# EAGLE design PS-VCO (EAGLE 6.6.0)

## Sheet 1 of 3
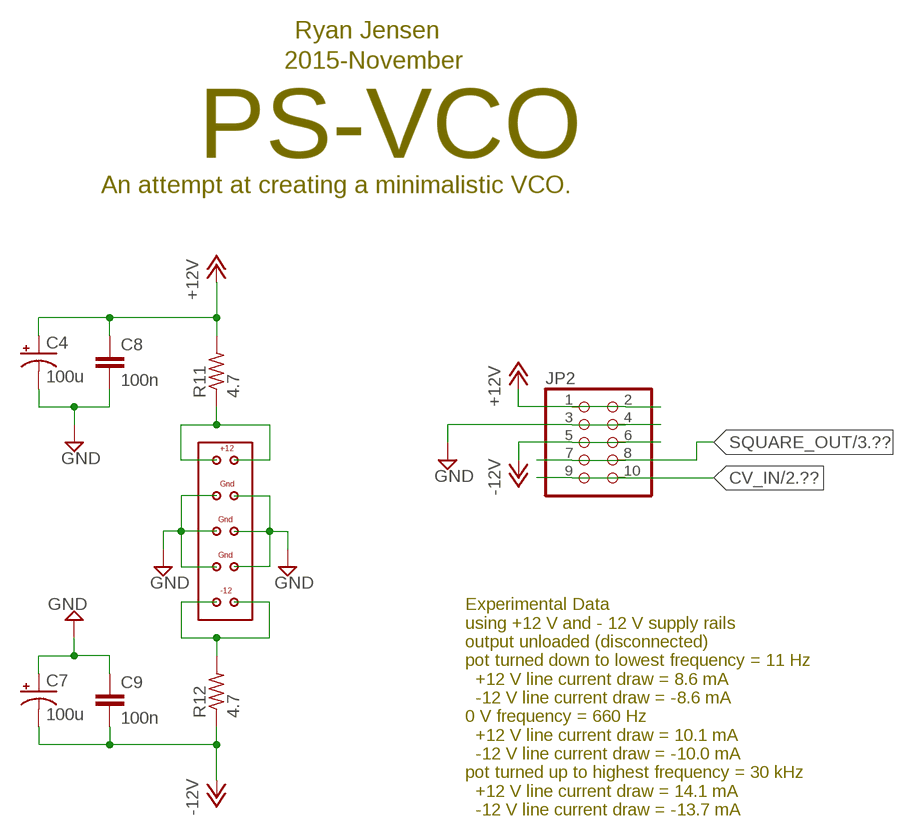
[diagram p0: schematic, sheet 1]

### Parts
C4  100u  CPOL-USE2.5-7  [E2,5-7]
C7  100u  CPOL-USE2.5-7  [E2,5-7]
C8  100n  C-EUC0603  [C0603]
C9  100n  C-EUC0603  [C0603]
JP2  PINHD-2X5  [2X05]
R11  4.7  R-US_R0603  [R0603]
R12  4.7  R-US_R0603  [R0603]
U$3  EURORACK-POWER  [EURORACK-POWER]

### Nets
+12V: C4.+ C8.1 JP2.1 JP2.2 R11.2 ; also sheet 2,3
-12V: C7.- C9.2 JP2.5 JP2.6 R12.1 ; also sheet 2,3
CV_IN: JP2.9 JP2.10 ; also sheet 2
GND: C4.- C7.+ C8.2 C9.1 JP2.3 JP2.4 U$3.P$3 U$3.P$4 U$3.P$5 U$3.P$6 U$3.P$7 U$3.P$8 ; also sheet 2,3
N$2: R12.2 U$3.P$9 U$3.P$10
N$5: R11.1 U$3.P$1 U$3.P$2
SQUARE_OUT: JP2.7 JP2.8 ; also sheet 3

### Notes on the sheet
- Ryan Jensen
- 2015-November
- PS-VCO
- An attempt at creating a minimalistic VCO.
- Experimental Data
  using +12 V and - 12 V supply rails
  output unloaded (disconnected)
  pot turned down to lowest frequency = 11 Hz
    +12 V line current draw = 8.6 mA
    -12 V line current draw = -8.6 mA
  0 V frequency = 660 Hz
    +12 V line current draw = 10.1 mA
    -12 V line current draw = -10.0 mA
  pot turned up to highest frequency = 30 kHz
    +12 V line current draw = 14.1 mA
    -12 V line current draw = -13.7 mA

## Sheet 2 of 3
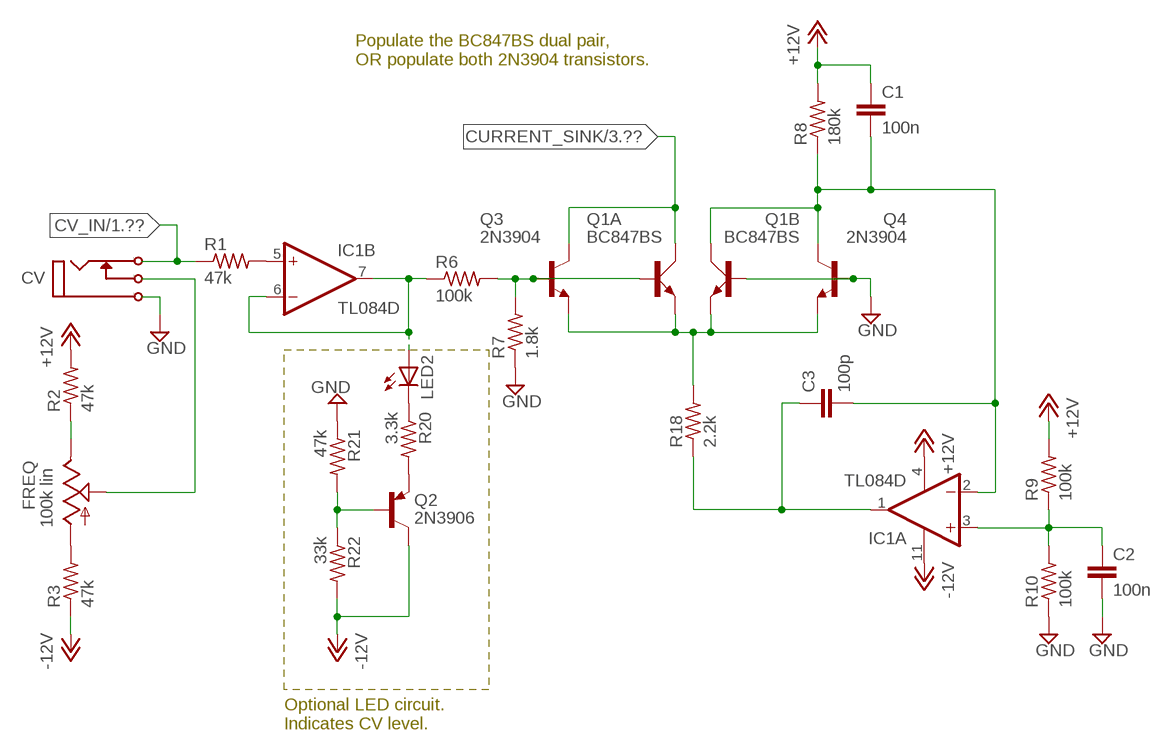
[diagram p1: schematic, sheet 2]

### Parts
C1  100n  C-EUC0603  [C0603]
C2  100n  C-EUC0603  [C0603]
C3  100p  C-EUC0603  [C0603]
CV  CV  MONO_JACK  [MONO_JACK]
FREQ  100k lin  TRIM_US-B64Y  [B64Y]
IC1  TL084D  [SO14]
LED2  LED_ELD260  [LED_LD260]
Q1  BC847BS  [SOT363_PHILIPS]
Q2  2N3906  [TO92]
Q3  2N3904  [TO92]
Q4  2N3904  [TO92]
R1  47k  R-US_R0603  [R0603]
R2  47k  R-US_R0603  [R0603]
R3  47k  R-US_R0603  [R0603]
R6  100k  R-US_R0603  [R0603]
R7  1.8k  R-US_R0603  [R0603]
R8  180k  R-US_R0603  [R0603]
R9  100k  R-US_R0603  [R0603]
R10  100k  R-US_R0603  [R0603]
R18  2.2k  R-US_R0603  [R0603]
R20  3.3k  R-US_R0603  [R0603]
R21  47k  R-US_R0603  [R0603]
R22  33k  R-US_R0603  [R0603]

### Nets
+12V: C1.1 IC1.4(P:V+) R2.2 R8.2 R9.2 ; also sheet 1,3
-12V: IC1.11(P:V-) Q2.1(C) R3.1 R22.2 ; also sheet 1,3
CURRENT_SINK: Q1.6(A:C) Q3.1(C) ; also sheet 3
CV_IN: CV.P$2(P2) R1.1 ; also sheet 1
CV_LED: IC1.6(B:-IN) IC1.7(B:OUT) LED2.A R6.1
GND: C2.2 CV.P$1 Q1.5(B:B) Q4.2(B) R7.1 R10.1 R21.1 ; also sheet 1,3
N$3: Q1.1(A:E) Q1.4(B:E) Q3.3(E) Q4.3(E) R18.2
N$4: Q1.2(A:B) Q3.2(B) R6.2 R7.2
N$6: C2.1 IC1.3(A:+IN) R9.1 R10.2
N$7: FREQ.E R2.1
N$8: FREQ.A R3.2
N$9: CV.P$3(P3) FREQ.S
N$11: IC1.5(B:+IN) R1.2
N$13: Q2.3(E) R20.2
N$14: LED2.K(C) R20.1
N$15: Q2.2(B) R21.2 R22.1
N$21: C3.1 IC1.1(A:OUT) R18.1
N$22: C1.2 C3.2 IC1.2(A:-IN) Q1.3(B:C) Q4.1(C) R8.1

### Notes on the sheet
- Populate the BC847BS dual pair,
  OR populate both 2N3904 transistors.
- Optional LED circuit.
  Indicates CV level.

## Sheet 3 of 3
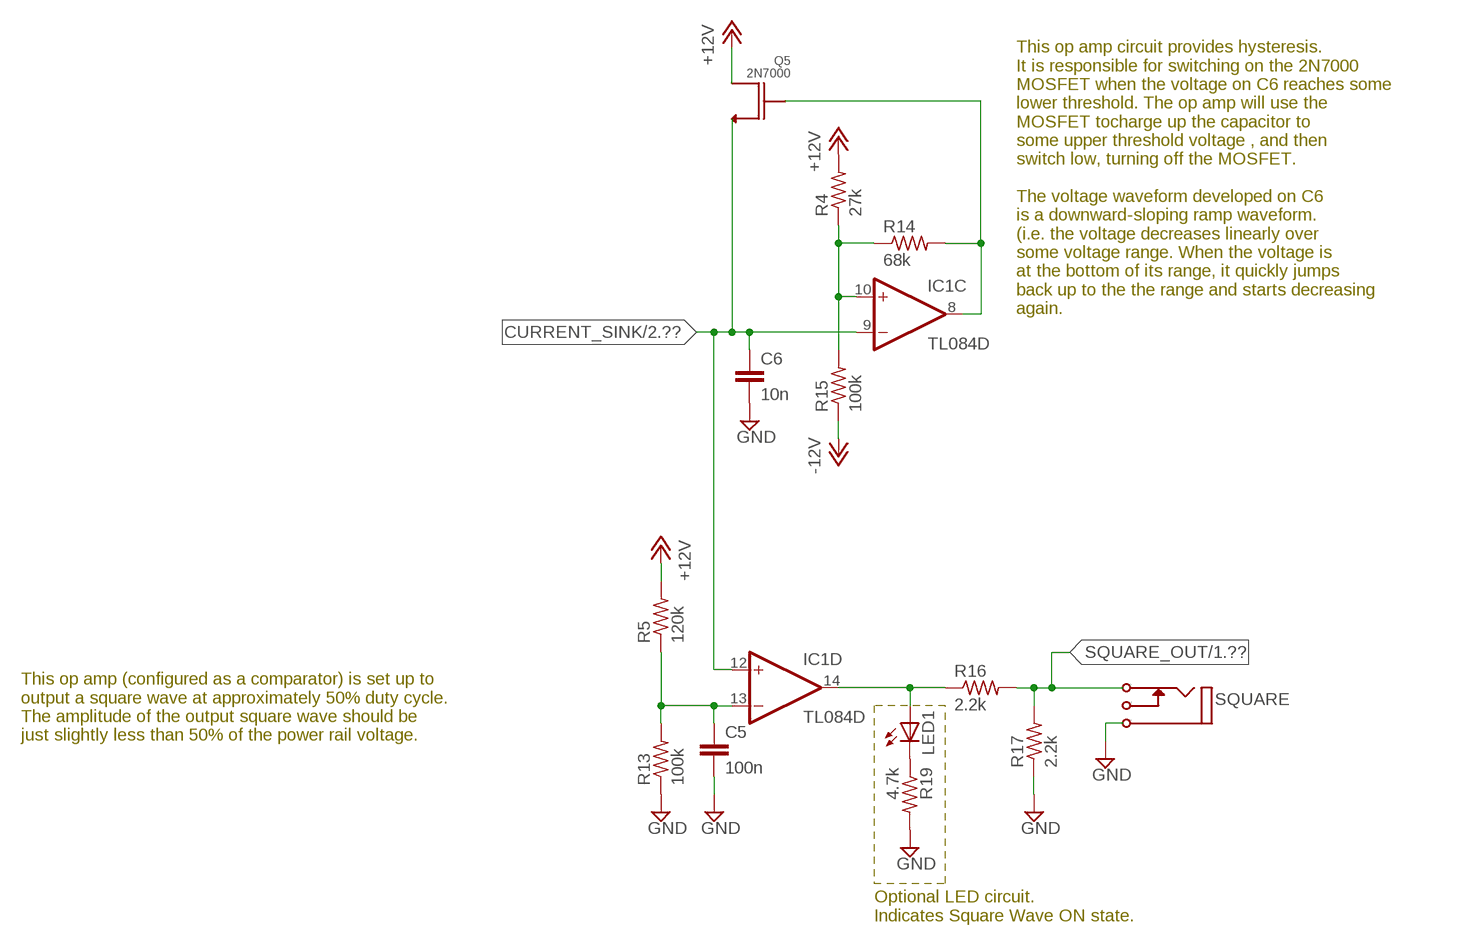
[diagram p2: schematic, sheet 3]

### Parts
C5  100n  C-EUC0603  [C0603]
C6  10n  C-EUC0603  [C0603]
LED1  LED_ELD260  [LED_LD260]
Q5  2N7000  [2N7000]
R4  27k  R-US_R0603  [R0603]
R5  120k  R-US_R0603  [R0603]
R13  100k  R-US_R0603  [R0603]
R14  68k  R-US_R0603  [R0603]
R15  100k  R-US_R0603  [R0603]
R16  2.2k  R-US_R0603  [R0603]
R17  2.2k  R-US_R0603  [R0603]
R19  4.7k  R-US_R0603  [R0603]
SQUARE  I/O  MONO_JACK  [MONO_JACK]

### Nets
+12V: Q5.D R4.2 R5.2 ; also sheet 1,2
-12V: R15.1 ; also sheet 1,2
CURRENT_SINK: C6.1 IC1.9(C:-IN) IC1.12(D:+IN) Q5.S ; also sheet 2
GND: C5.2 C6.2 R13.1 R17.1 R19.2 SQUARE.P$1 ; also sheet 1,2
N$1: IC1.10(C:+IN) R4.1 R14.1 R15.2
N$12: LED1.K(C) R19.1
N$16: C5.1 IC1.13(D:-IN) R5.1 R13.2
N$18: IC1.14(D:OUT) LED1.A R16.1
N$19: IC1.8(C:OUT) Q5.G R14.2
SQUARE_OUT: R16.2 R17.2 SQUARE.P$2(P2) ; also sheet 1
Unconnected: SQUARE.P$3(P3)

### Notes on the sheet
- This op amp circuit provides hysteresis.
  It is responsible for switching on the 2N7000
  MOSFET when the voltage on C6 reaches some
  lower threshold. The op amp will use the
  MOSFET tocharge up the capacitor to
  some upper threshold voltage , and then
  switch low, turning off the MOSFET.
  
  The voltage waveform developed on C6
  is a downward-sloping ramp waveform.
  (i.e. the voltage decreases linearly over
  some voltage range. When the voltage is
  at the bottom of its range, it quickly jumps
  back up to the the range and starts decreasing
  again.
- This op amp (configured as a comparator) is set up to
  output a square wave at approximately 50% duty cycle.
  The amplitude of the output square wave should be
  just slightly less than 50% of the power rail voltage.
- Optional LED circuit.
  Indicates Square Wave ON state.

## Library data of the parts
C1-C3 C5 C6 C8 C9 = rcl:C-EU: CAPACITOR, European symbol
C4 C7 = rcl:CPOL-US: POLARIZED CAPACITOR, American symbol
CV = !synth_sch:MONO_JACK; VALUE: I/O
FREQ = pot:TRIM_US-: POTENTIOMETER
IC1 = linear:TL084: OP AMP
JP2 = pinhead:PINHD-2X5: PIN HEADER
LED1 LED2 = eagle-ltspice:LED_E: LED Source: http://www.osram.convergy.de Source: www.luxeon.com Source: www.kingbright.com; SPICEMODEL: NONE; SPICEPREFIX: D; SPICETYPE: diode
Q1 = transistor-small-signal:BC847BS: NPN general purpose double transistor Source: http://www.farnell.com/datasheets/2466.pdf
Q2 = transistor-pnp:2N3906: PNP Transistor
Q3 Q4 = transistor:2N3904: NPN TRANSISTOR
Q5 = !synth_sch:2N7000
R1-R22 = rcl:R-US_: RESISTOR, American symbol
SQUARE = !synth_sch:MONO_JACK
U$3 = !synth_sch:EURORACK-POWER

## Board
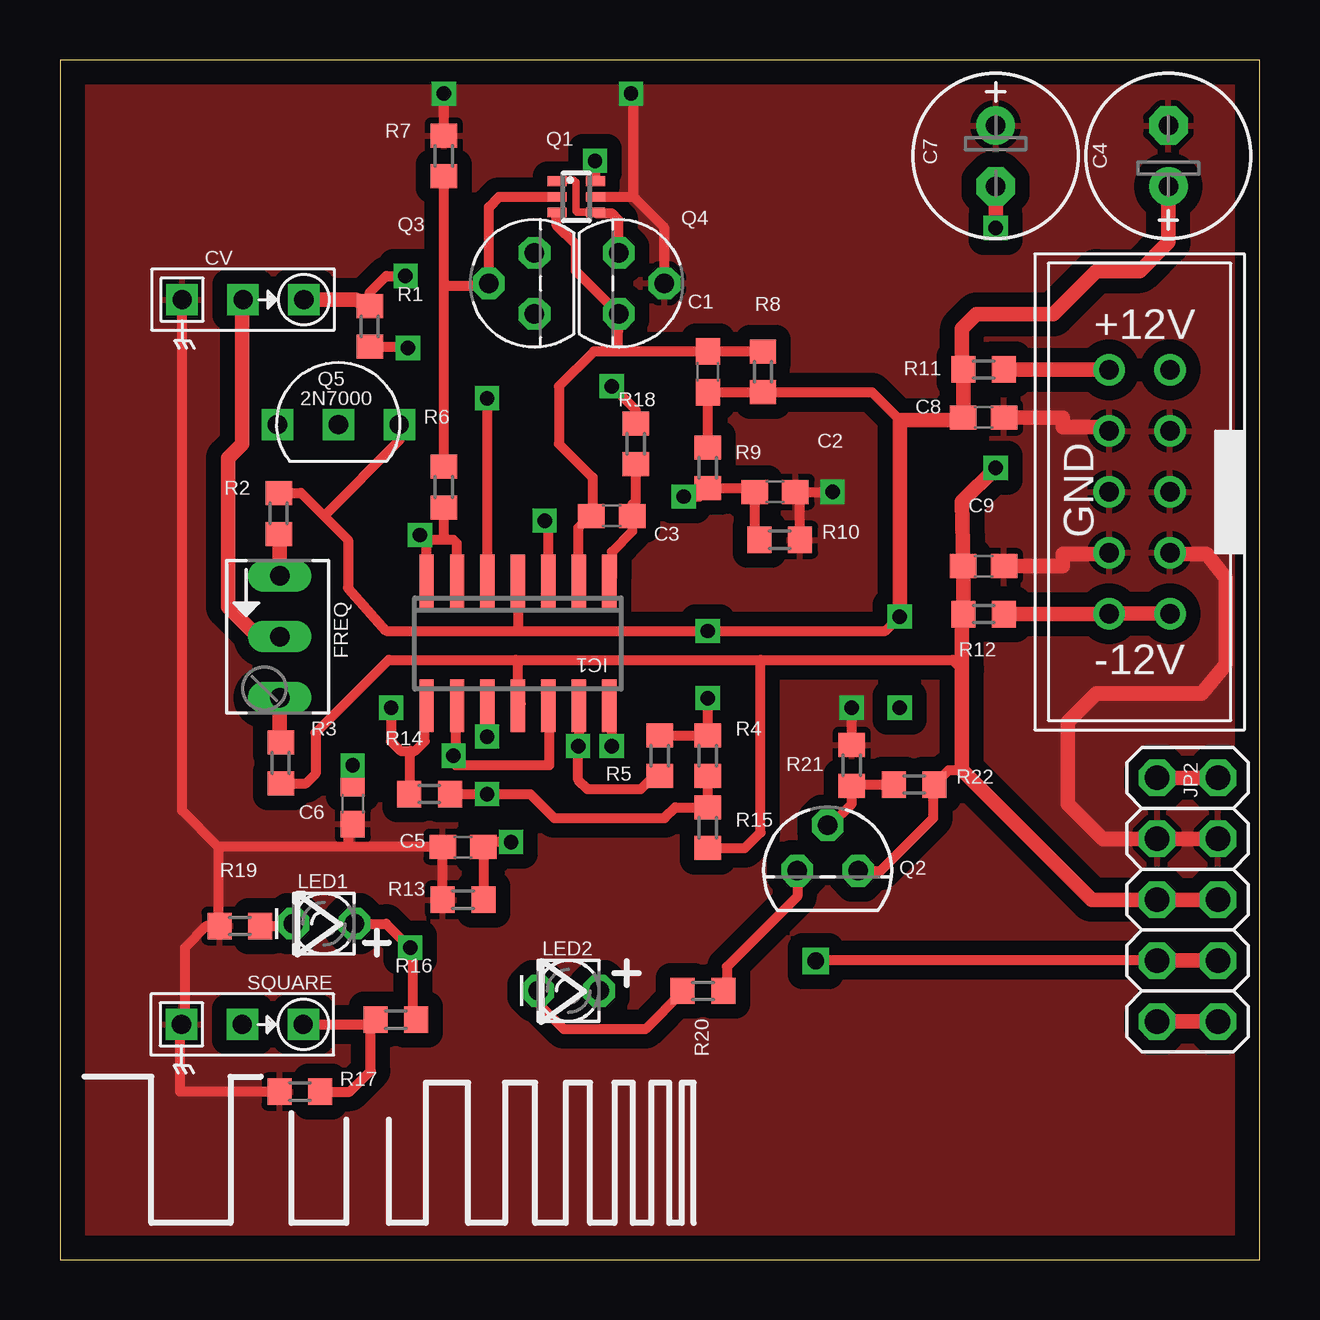
[diagram p3: board, top side]
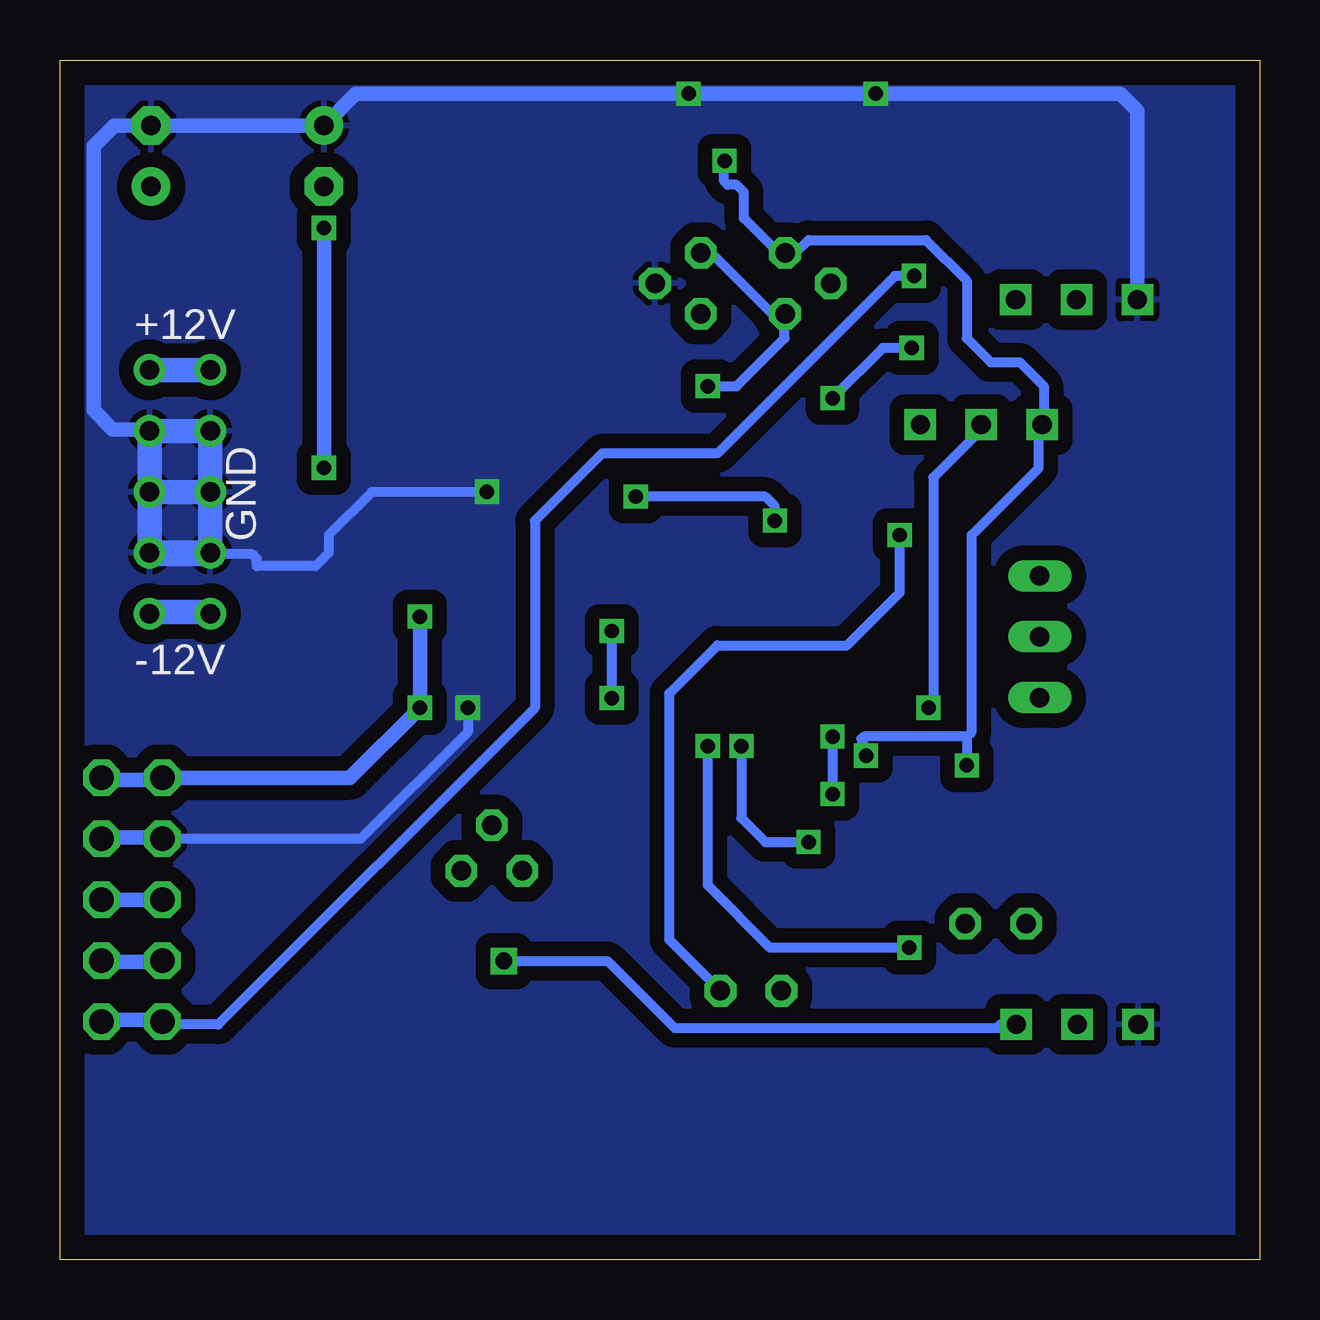
[diagram p4: board, bottom side, seen from below]

Size 50 x 50 mm. Coordinates in mm from the lower left corner, seen from the top.
Outline: 0,0 50,0 50,50 0,50 0,0
Copper layers (1*16): Top 0.035mm / dielectric 1.5mm / Bottom 0.035mm
Design rules "default": minimum track width 10mil, minimum drill 24mil, track to track 8mil, track to pad 8mil, pad to pad 8mil, via to via 8mil, smd to smd 8mil, copper to edge 40mil, drill to drill 8mil, minimum pad ring 10mil, minimum via ring 8mil, stop-mask expansion 4mil, vias tented up to drill 0mil, thermal gap 10mil

### Footprints (pad centres in the part's own frame; a part is rotated, then mirrored left to right if it is on the bottom)
C0603 = smd 1.1 x 1: 1 -0.85,0; 2 0.85,0
E2,5-7 = drill 0.813 pad 1.6: + -1.27,0 | drill 0.813 pad 1.6 octagon: - 1.27,0
MONO_JACK = drill 0.8 square: P$1 -2.54,0; P$2 2.54,0; P$3 0,0
B64Y = drill 0.813 long: A 2.54,0; E -2.54,0; S 0,0
SO14 = smd 0.6 x 2.2: 1 -3.81,-2.6; 2 -2.54,-2.6; 3 -1.27,-2.6; 4 0,-2.6; 5 1.27,-2.6; 6 2.54,-2.6; 7 3.81,-2.6; 8 3.81,2.6; 9 2.54,2.6; 10 1.27,2.6; 11 0,2.6; 12 -1.27,2.6; 13 -2.54,2.6; 14 -3.81,2.6
2X05 = drill 1.016 octagon: 1 -5.08,-1.27; 2 -5.08,1.27; 3 -2.54,-1.27; 4 -2.54,1.27; 5 0,-1.27; 6 0,1.27; 7 2.54,-1.27; 8 2.54,1.27; 9 5.08,-1.27; 10 5.08,1.27
LED_LD260 = drill 0.813 octagon: A -1.27,0; K 1.27,0
SOT363_PHILIPS = smd 0.4 x 0.8: 1 -0.65,-0.8; 2 0,-0.8; 3 0.65,-0.8; 4 0.65,0.8; 5 0,0.8; 6 -0.65,0.8
TO92 = drill 0.813 octagon: 1 1.27,0; 2 0,1.905; 3 -1.27,0
2N7000 = drill 0.8 square: D 2.54,0; G 0,0; S -2.54,0
R0603 = smd 1 x 1.1: 1 -0.85,0; 2 0.85,0
EURORACK-POWER = drill 0.8: P$1 -1.27,5.08; P$2 1.27,5.08; P$3 -1.27,2.54; P$4 1.27,2.54; P$5 -1.27,0; P$6 1.27,0; P$7 -1.27,-2.54; P$8 1.27,-2.54; P$9 -1.27,-5.08; P$10 1.27,-5.08

### Placement (x,y rotation side)
C1  27,37 90 top
C2  29.8,32 0 top
C3  23,31 180 top
C4  46.2,46 90 top
C5  16.8,17.2 180 top
C6  12.2,19 270 top
C7  39,46 270 top
C8  38.5,35.1 0 top
C9  38.5,28.9 180 top
CV  7.63,40.01 0 top
FREQ  9.16,25.96 270 top
IC1  19.09,25.68 180 top
JP2  47,15 270 top
LED1  11,14 180 top
LED2  21.2,11.2 180 top
Q1  21.52,44.3 270 top
Q2  32,16.2 0 top
Q3  19.78,40.69 90 top
Q4  23.29,40.69 270 top
Q5  11.6,34.8 0 top
R1  12.91,38.9 270 top
R2  9.12,31.1 90 top
R3  9.2,20.7 90 top
R4  27,21 90 top
R5  25,21 90 top
R6  16,32.2 90 top
R7  16,46 270 top
R8  29.3,37 270 top
R9  27,33 90 top
R10  30,30 180 top
R11  38.5,37.1 180 top
R12  38.5,26.9 0 top
R13  16.8,15 0 top
R14  15.4,19.4 180 top
R15  27,18 90 top
R16  14,10 180 top
R17  10,7 0 top
R18  24,34 90 top
R19  7.5,13.9 180 top
R20  26.8,11.2 0 top
R21  33,20.6 270 top
R22  35.6,19.8 0 top
SQUARE  7.6,9.8 0 top
U$3  45,32 0 top

### Tracks (layer width: path | path; a pad name or v marks a point on that pad's centre or on a via)
+12V  (via drill 0.6)
  Top 0.406: R2.2 10.05,31.95 11,31 | 11,31 12,30 12,28 13.6,26.2 19.2,26.2 | 19,28.19 IC1.4 19.09,26.31 19.2,26.2 | 19.2,26.2 v27,26.2 34.4,26.2 v35,26.8 | Q5.D 14.14,34.14 11,31 | R9.2 C1.1 R8.2 33.85,36.15 35,35 | v27,23.4 R4.2 R5.2
  Top 0.61: C4.+ 46.2,42.4 45,41.2 43.2,41.2 41.4,39.4 38.2,39.4 37.6,38.8 37.6,37.1 R11.2 C8.1 37.55,35 35,35 v35,26.8 | JP2.2 JP2.1
  Bottom 0.406: v27,23.4 v27,26.2
  Bottom 0.61: JP2.1 37.92,20.08 v35,23 v35,26.8
-12V  (via drill 0.6)
  Top 0.406: R3.1 10.25,19.85 10.65,20.25 10.65,21.95 13.7,25 19,25 | 19.2,23.17 IC1.11 19.09,24.91 19,25 | 19,25 29.2,25 | 29.2,25 37.2,25 37.6,24.6 | R15.1 28.55,17.15 29.2,17.8 29.2,25 | 37.6,20.4 37.05,20.4 R22.2 36.4,19.75 36.4,18.4 34.2,16.2 Q2.1
  Top 0.61: C7.- v39,43 | v39,33 37.6,31.6 C9.2 R12.1 37.6,26.85 37.6,24.6 37.6,20.4 43,15 JP2.5 JP2.6
  Bottom 0.61: v39,43 v39,33
CURRENT_SINK  (via drill 0.6)
  Top 0.406: v22.3,45.8 22.3,44.97 Q1.6 | IC1.9 16.5,23.03 16.5,21.4 16.6,21.3 | 16.6,21.3 16.5,20.6 20.4,20.6 20.4,22.2 20.36,22.24 IC1.12 | 16.6,21.3 v16.4,21 | v12.2,20.6 C6.1
  Bottom 0.406: v22.3,45.8 22.32,45.78 Q1.6 22.17,44.8 21.8,44.8 21.5,44.5 21.5,43.4 20.06,41.96 Q3.1 19.34,41.96 18.8,42.5 13.9,42.5 12.2,40.8 12.2,38.4 11.2,37.4 10,37.4 9,36.4 9,34.86 Q5.S 9.2,34.66 9.2,33 12,30.2 12,22 12.2,21.8 | 12.2,21.8 16.5,21.8 16.6,21.7 v16.4,21 | 12.2,21.8 v12.2,20.6
CV_IN  (via drill 0.6)
  Top 0.406: R1.1 12.91,40.31 13.6,41 v14.4,41
  Top 0.61: JP2.9 JP2.10 | CV.P$2 12.35,40.01 R1.1
  Bottom 0.406: v14.4,41 15.2,41 22.6,33.6 27.4,33.6 30.2,30.8 30.2,23 43.4,9.8 45.61,9.8 JP2.9
CV_LED  (via drill 0.6)
  Top 0.406: IC1.6 16.55,29.85 16.4,30 16,30 | IC1.7 15.28,29.88 15.4,30 | 16,30 R6.1 | 16,30 15.4,30 | v15,30.2 15.4,30
  Bottom 0.406: LED2.A 24.6,13.33 24.6,23.6 22.6,25.6 17.2,25.6 15,27.8 v15,30.2
GND  (via drill 0.6)
  Top 0.406: Q4.2 25.2,43.01 23.9,44.3 | Q1.5 23.9,44.3 | 23.9,44.3 23.9,48.7 v23.8,48.6 | R7.1 v16,48.6 | R17.1 5,7 5,9.74 SQUARE.P$1 5.2,9.94 5.2,13 6.1,13.9 R19.2 6.6,13.95 6.6,17.2 | 12,17.2 6.6,17.2 | R10.1 30.85,31.8 C2.2 v32.2,32 | R13.1 C5.2 12,17.2 | C6.2 12,17.95 12,17.2 | 6.6,17.2 5.09,18.71 CV.P$1 | R21.1 v33,23
  Top 0.61: C8.2 41.8,35.1 41.8,34.7 43.73,34.7 U$3.P$3 | C9.1 41.8,28.9 41.8,29.4 43.73,29.4 U$3.P$7 | JP2.4 JP2.3 43.46,17.54 42,19 42,22.4 43.2,23.6 47.6,23.6 48.6,24.8 48.6,28.4 47.8,29.4 46.33,29.4 U$3.P$8
  Bottom 0.406: v32.2,32 37,32 38.8,30.2 38.8,29.45 C9.1 41.8,28.9 41.8,29.2 42,29.4 43.67,29.4 U$3.P$7 | v33,23 33,22 37.46,17.54 JP2.3
  Bottom 0.61: C4.- C7.+ | C7.+ 47.73,47.27 48.6,46.4 48.6,35.4 47.8,34.6 46.33,34.6 U$3.P$4 | CV.P$1 5.09,47.89 5.8,48.6 v16,48.6 v23.8,48.6 37.67,48.6 C7.+
  Bottom 1.016: U$3.P$6 U$3.P$4 U$3.P$3 U$3.P$5 | U$3.P$5 U$3.P$6 | 46.3,32 U$3.P$6 | U$3.P$6 U$3.P$8 | U$3.P$5 U$3.P$7 46.2,29.46 46.2,29.4 43.8,29.4
  pour Bottom (isolate 0.61): 0,0 0,50 50,50 50,0
  pour Top (isolate 0.61): 0,50 0,0 50,0 50,50
N$1  (via drill 0.6)
  Top 0.406: R4.1 R15.2 25.65,18.85 25.2,18.4 20.6,18.4 19.6,19.4 v17.8,19.4 R14.1 | IC1.10 17.8,23.06 v17.8,21.8
  Bottom 0.406: v17.8,21.8 v17.8,19.4
N$2
  Top 0.61: R12.2 43.73,26.9 U$3.P$9 U$3.P$10
N$3  (via drill 0.6)
  Top 0.305: Q1.4 21.55,43.65 21.5,43.7 21.5,44.9 21.4,45 20.77,45 Q1.1
  Top 0.406: Q4.3 23.29,43.31 23,43.6 22.37,43.6 Q1.4 | R18.2 24,35.4 v23,36.4
  Bottom 0.406: Q4.3 23.13,41.8 22.7,41.8 20.32,39.42 Q3.3 19.8,39.4 19.8,38.4 21.8,36.4 v23,36.4
N$4
  Top 0.406: 16,40.6 R7.2 | R6.2 16,40.6 | 16,40.6 17.79,40.6 Q3.2 17.88,43.88 18.3,44.3 Q1.2
N$5
  Top 0.61: R11.1 43.73,37.1 U$3.P$1
  Bottom 1.016: U$3.P$2 U$3.P$1
N$6  (via drill 0.6)
  Top 0.406: IC1.3 20.36,30.64 v20.2,30.8 | v26,31.8 26.65,31.8 R9.1 28.8,32.15 C2.1 28.95,30.2 R10.2
  Bottom 0.406: v20.2,30.8 20.2,31.4 20.6,31.8 v26,31.8
N$7
  Top 0.61: FREQ.E 9.16,30.21 R2.1
N$8
  Top 0.61: FREQ.A 9.16,21.59 R3.2
N$9
  Top 0.61: FREQ.S 8.24,25.96 7,27.2 7,33.4 7.6,34 7.6,39.98 CV.P$3
N$10
  Bottom 1.016: 46,27 43.8,27
N$11  (via drill 0.6)
  Top 0.406: R1.2 14.45,38.05 v14.5,38 | v17.8,35.9 17.8,28.3 IC1.5
  Bottom 0.406: v14.5,38 15.7,38 v17.8,35.9
N$12
  Top 0.406: R19.1 9.63,13.9 LED1.K
N$13
  Top 0.406: Q2.3 30.73,15.13 27.8,12.2 27.8,11.35 R20.2
N$14
  Top 0.406: R20.1 25.95,11.15 24.4,9.6 21,9.6 20,10.6 20,11.13 LED2.K
N$15
  Top 0.406: R22.1 33.05,19.8 R21.2 33,19 32.1,18.11 Q2.2
N$16  (via drill 0.6)
  Top 0.406: IC1.13 21.63,21.43 v21.6,21.4 21.6,20 22,19.6 24.2,19.6 24.75,20.15 R5.1 | v18.8,17.4 17.85,17.4 C5.1 R13.2
  Bottom 0.406: v21.6,21.4 21.6,18.4 20.6,17.4 v18.8,17.4
N$17
  Bottom 0.61: 46,10 48,10
N$18  (via drill 0.6)
  Top 0.406: LED1.A 13.6,14 v14.6,13 14.7,12.9 14.7,10.15 R16.1 | v23,21.4 23,22.98 IC1.14
  Bottom 0.406: v14.6,13 20.4,13 23,15.6 v23,21.4
N$19  (via drill 0.6)
  Top 0.406: v13.8,23 13.8,21.6 14.2,21.2 14.6,21.2 | 14.6,21.2 14.8,21.2 15.2,21.6 15.2,23 IC1.8 | R14.2 14.6,19.45 14.6,21.2
  Bottom 0.406: Q5.G 11.6,34.6 13.6,32.6 13.6,23.2 v13.8,23
N$20
  Bottom 0.61: 45.8,12.4 48.2,12.4
N$21
  Top 0.406: IC1.1 23,28.38 23,29.5 23.85,30.35 C3.1 23.85,31.45 24,31.6 R18.1
N$22
  Top 0.406: Q1.3 20.7,43.63 20.7,43.1 21.5,42.3 21.5,41.2 Q4.1 23.26,37.85 | IC1.2 21.6,28.31 21.6,30.5 22.1,31 C3.2 22.2,31.05 22.2,32.6 20.8,34 20.8,36.4 22.25,37.85 23.26,37.85 | R8.1 C1.2 23.26,37.85
N$23
  Bottom 0.61: 45.8,15 48.2,15
N$24
  Bottom 0.61: 45.8,17.6 48.2,17.6
N$25
  Bottom 0.61: 45.8,20 48.2,20
SQUARE_OUT  (via drill 0.7)
  Top 0.406: SQUARE.P$2 12.95,9.8 R16.2 12.95,9.8 12.95,7.87 12.08,7 R17.2 | JP2.7 v31.51,12.46 v31.5,12.45
  Top 0.61: JP2.8 JP2.7
  Bottom 0.406: v31.5,12.45 27.18,12.45 24.38,9.65 10.82,9.65 | 10.82,9.65 10.67,9.8 | SQUARE.P$2 10.82,9.8 10.82,9.65

### Text on the board
tValues: +12 | GND | -12 | SQUARE | CV_IN | PS-VCO | 2015 | Ryan Jensen